# EAGLE design wagband_schematic_post_route (EAGLE 7.5.0)
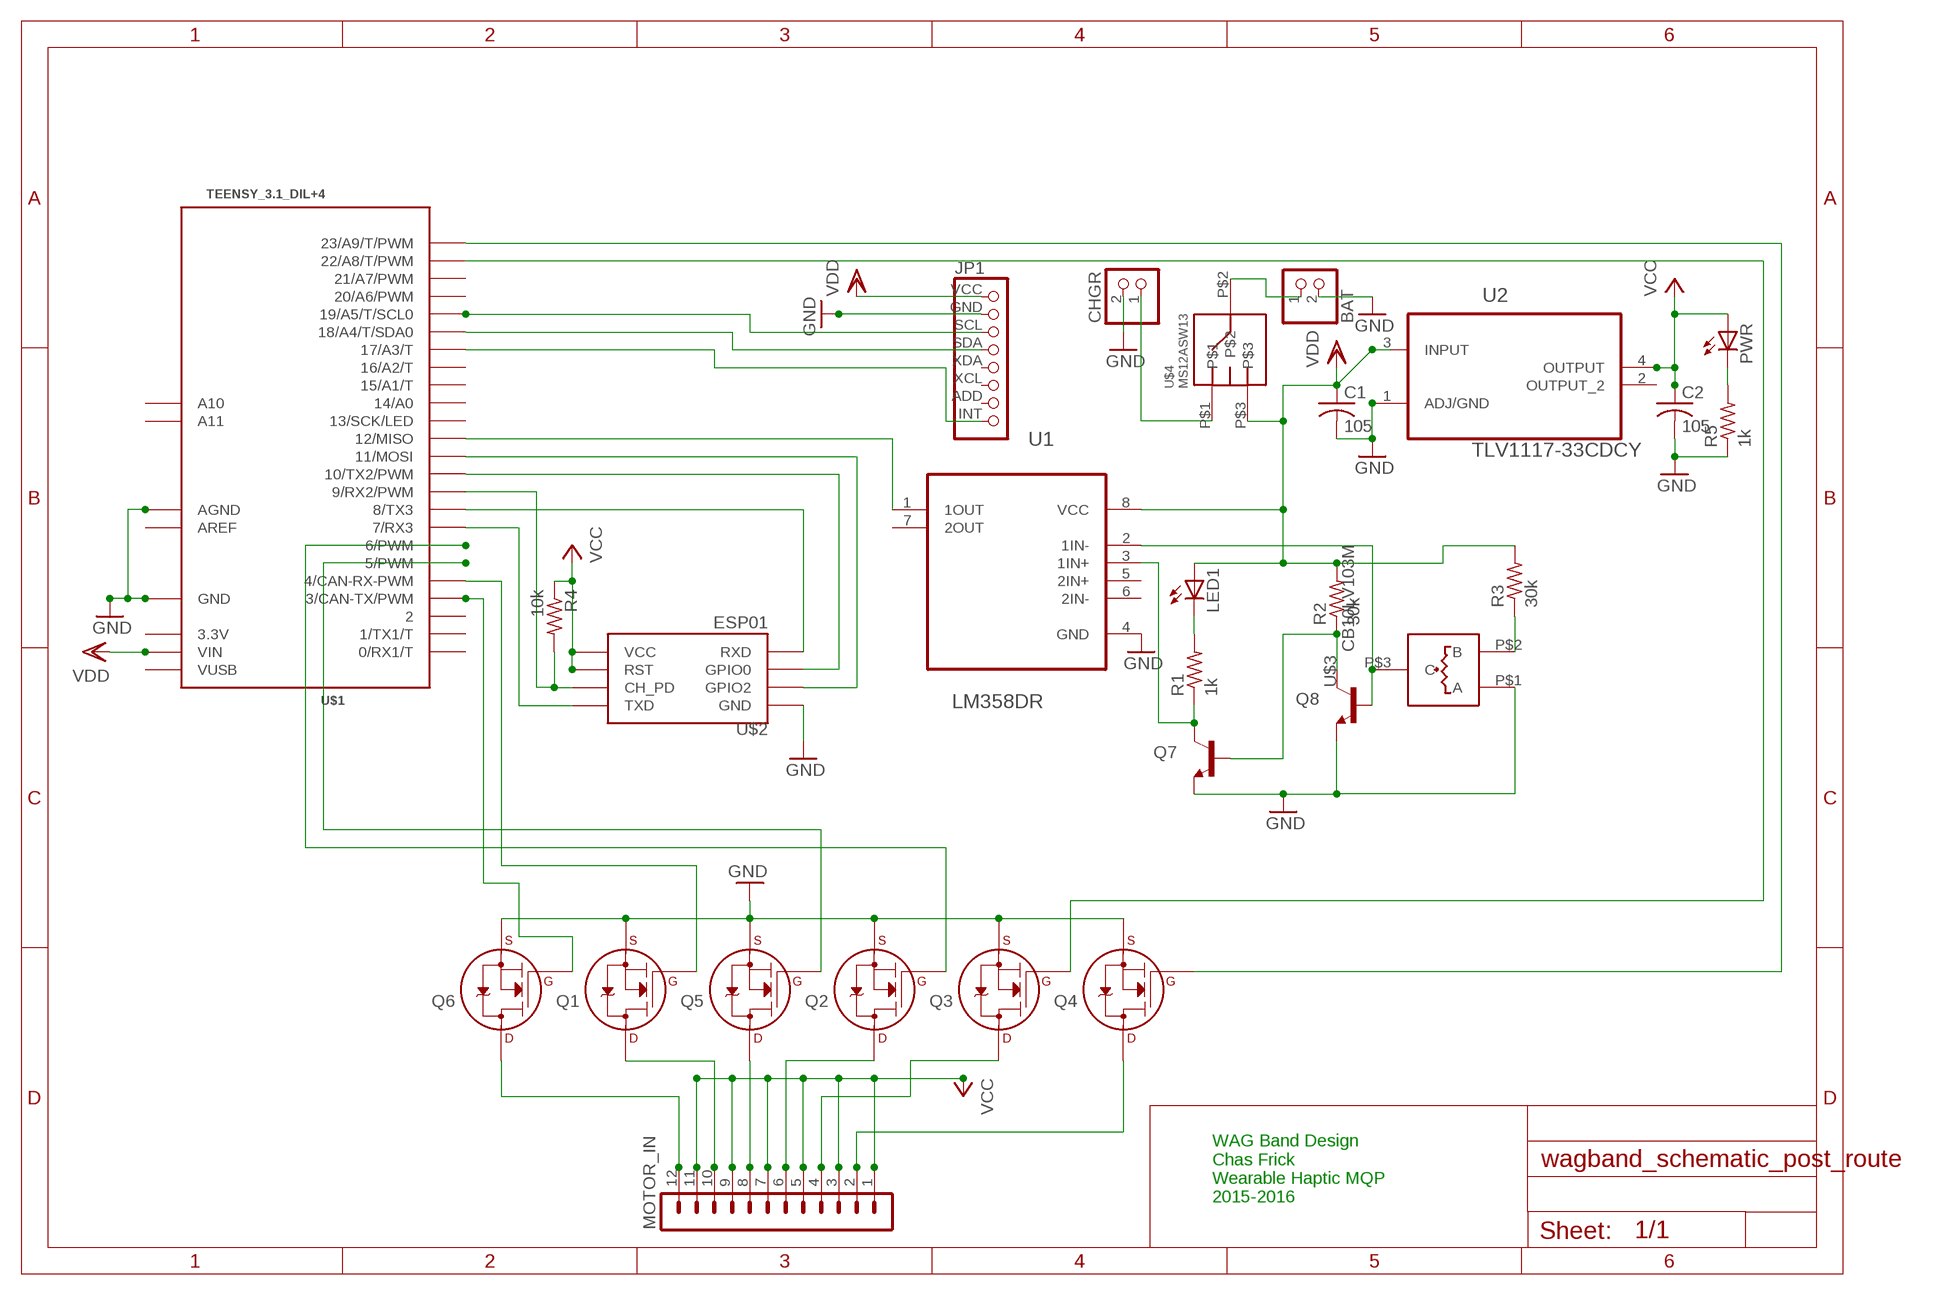
[diagram p0: schematic, sheet 1]

## Parts
BAT  JST_2PIN-THM-RA  [JST-PH-2-THM-RA]
C1  105  C-USC0805K  [C0805K]
C2  105  C-USC0805K  [C0805K]
CHGR  JST_2PIN-THM-RA  [JST-PH-2-THM-RA]
JP1  MPU6050_BREAKOUT  [MPU6050]
LED1  LED5MM  [LED5MM]
MOTOR_IN  MA12-1W  [MA12-1W]
PWR  LED5MM  [LED5MM]
Q1  2N7000_SOT23  [SOT-23]
Q2  2N7000_SOT23  [SOT-23]
Q3  2N7000_SOT23  [SOT-23]
Q4  2N7000_SOT23  [SOT-23]
Q5  2N7000_SOT23  [SOT-23]
Q6  2N7000_SOT23  [SOT-23]
Q7  TRANSISTOR_NPNMMBT3904  [SOT-23]
Q8  TRANSISTOR_NPNMMBT3904  [SOT-23]
R1  1k  R-US_R1206  [R1206]
R2  30k  R-US_R1206  [R1206]
R3  30k  R-US_R1206  [R1206]
R4  10k  R-US_R1206  [R1206]
R5  1k  R-US_R1206  [R1206]
U1  LM358DR  [SOIC127P600X175-8N]
U2  TLV1117-33CDCY  [SOT230P700X180-4N]
U$1  TEENSY_3.1_DIL+4  [TEENSY3-DIL+4]
U$2  ESP01  [ESP01]
U$3  CB10LV103M  [CB10]
U$4  MS12ASW13  [SPDT]

## Nets
GND [GND]: BAT.2 C1.2 C2.2 CHGR.2 JP1.GND Q1.2(S) Q2.2(S) Q3.2(S) Q4.2(S) Q5.2(S) Q6.2(S) Q7.2(E) Q8.2(E) R5.1 U1.4(GND) U2.1(ADJ/GND) U$1.AGND U$1.GND U$2.GND U$3.P$1(A)
N$1: Q4.1(G) U$1.23/A9(23/A9/T/PWM)
N$2: Q2.1(G) U$1.6(6/PWM)
N$3: Q3.1(G) U$1.22/A8(22/A8/T/PWM)
N$4: JP1.SDA U$1.18/A4(18/A4/T/SDA0)
N$5: Q6.1(G) U$1.3(3/CAN-TX/PWM)
N$6: Q1.1(G) U$1.4(4/CAN-RX-PWM)
N$7: U$1.7(7/RX3) U$2.TX(TXD)
N$8: JP1.INT U$1.17/A3(17/A3/T)
N$9: MOTOR_IN.12 Q6.3(D)
N$10: MOTOR_IN.10 Q1.3(D)
N$11: MOTOR_IN.8 Q5.3(D)
N$12: U$1.8(8/TX3) U$2.RX(RXD)
N$13: MOTOR_IN.6 Q2.3(D)
N$14: MOTOR_IN.2 Q4.3(D)
N$15: MOTOR_IN.4 Q3.3(D)
N$16: Q5.1(G) U$1.5(5/PWM)
N$17: JP1.SCL U$1.19/A5(19/A5/T/SCL0)
N$18: U$1.11(11/MOSI) U$2.GPIO2
N$19: U$1.10(10/TX2/PWM) U$2.GPIO0
N$20: Q7.3(C) R1.1 U1.3(1IN+)
N$21: PWR.K(C) R5.2
N$22: LED1.K(C) R1.2
N$23: Q7.1(B) Q8.3(C) R2.1
N$24: R4.2 U$1.9(9/RX2/PWM) U$2.CH_PD
N$25: Q8.1(B) U1.2(1IN-) U$3.P$3(C)
N$26: U1.1(1OUT) U$1.12(12/MISO)
N$27: R3.1 U$3.P$2(B)
N$28: BAT.1 U$4.P$2
N$29 [VCC]: CHGR.1 U$4.P$1
VCC [VCC]: C2.1 MOTOR_IN.1 MOTOR_IN.3 MOTOR_IN.5 MOTOR_IN.7 MOTOR_IN.9 MOTOR_IN.11 PWR.A R4.1 U2.4(OUTPUT) U$2.RST U$2.VCC
VDD [VCC]: C1.1 JP1.VCC LED1.A R2.2 R3.2 U1.8(VCC) U2.3(INPUT) U$1.VIN U$4.P$3
Unconnected: JP1.ADD JP1.XCL JP1.XDA U1.5(2IN+) U1.6(2IN-) U1.7(2OUT) U2.2(OUTPUT_2) U$1.0(0/RX1/T) U$1.1(1/TX1/T) U$1.2 U$1.13(13/SCK/LED) U$1.14/A0 U$1.15/A1(15/A1/T) U$1.16/A2(16/A2/T) U$1.20/A6(20/A6/PWM) U$1.21/A7(21/A7/PWM) U$1.A10 U$1.A11

## Notes on the sheet
- WAG Band Design
  Chas Frick
  Wearable Haptic MQP
  2015-2016

## Power pins joined to a net without a drawn wire
3.3V: U$1.3.3V
AREF: U$1.AREF
VUSB: U$1.VUSB

## Library data of the parts
BAT CHGR = adafruit:JST_2PIN: JST 2-Pin Connectors of various flavors SMT-RA (S2B-PH-SM4) 4UConnector #17311 SMT (B2B-PH-SM4) THM-RA (S2B-PH) THM (B2B-PH)
C1 C2 = resistor:C-US: CAPACITOR, American symbol
JP1 = mqp_custom_parts:MPU6050_BREAKOUT: PIN HEADER
LED1 PWR = led:LED: LED OSRAM: - CHIPLED LG R971, LG N971, LY N971, LG Q971, LY Q971, LO R971, LY R971 LH N974, LH R974 LS Q976, LO Q976, LY Q976 LO Q996 - Hyper CHIPLED LW Q18S LB Q993, LB Q99A, LB R99A - SideLED LS A670, LO A670, LY A670, LG A670, LP A670 LB A673, LV A673, LT A673, LW A673 LH A674 LY A675 LS A676, LA A676, LO A676, LY A676, LW A676 LS A679, LY A679, LG A679 - Hyper Micro SIDELED® LS Y876, LA Y876, LO Y876, LY Y876 LT Y87S - SmartLED LW L88C, LW L88S LB L89C, LB L89S, LG L890 LS L89K, LO L89K, LY L89K LS L896, LA L896, LO L896, LY L896 - TOPLED LS T670, LO T670, LY T670, LG T670, LP T670 LSG T670, LSP T670, LSY T670, LOP T670, LYG T670 LG T671, LOG T671, LSG T671 LB T673, LV T673, LT T673, LW T673 LH T674 LS T676, LA T676, LO T676, LY T676, LB T676, LH T676, LSB T676, LW T676 LB T67C, LV T67C, LT T67C, LS T67K, LO T67K, LY T67K, LW E67C LS E67B, LA E67B, LO E67B, LY E67B, LB E67C, LV E67C, LT E67C LW T67C LS T679, LY T679, LG T679 LS T770, LO T770, LY T770, LG T770, LP T770 LB T773, LV T773, LT T773, LW T773 LH T774 LS E675, LA E675, LY E675, LS T675 LS T776, LA T776, LO T776, LY T776, LB T776 LHGB T686 LT T68C, LB T68C - Hyper Mini TOPLED® LB M676 - Mini TOPLED Santana® LG M470 LS M47K, LO M47K, LY M47K Source: http://www.osram.convergy.de LUXEON: - LUMILED® LXK2-PW12-R00, LXK2-PW12-S00, LXK2-PW14-U00, LXK2-PW14-V00 LXK2-PM12-R00, LXK2-PM12-S00, LXK2-PM14-U00 LXK2-PE12-Q00, LXK2-PE12-R00, LXK2-PE12-S00, LXK2-PE14-T00, LXK2-PE14-U00 LXK2-PB12-K00, LXK2-PB12-L00, LXK2-PB12-M00, LXK2-PB14-N00, LXK2-PB14-P00, LXK2-PB14-Q00 LXK2-PR12-L00, LXK2-PR12-M00, LXK2-PR14-Q00, LXK2-PR14-R00 LXK2-PD12-Q00, LXK2-PD12-R00, LXK2-PD12-S00 LXK2-PH12-R00, LXK2-PH12-S00 LXK2-PL12-P00, LXK2-PL12-Q00, LXK2-PL12-R00 Source: www.luxeon.com KINGBRIGHT: KA-3528ASYC Source: www.kingbright.com
MOTOR_IN = con-lstb:MA12-1W: PIN HEADER; OC_FARNELL: unknown; OC_NEWARK: unknown
Q1-Q6 = mqp_custom_parts:2N700*: 2N7000, 2N7002, NDS7002A N-channel enhancement mode MOSFET
Q7 Q8 = mqp_custom_parts:TRANSISTOR_NPN: MMBT3904LT1G Made for the MMBT3904LT1G from ON Semiconductor See here: http://www.newark.com/on-semiconductor/mmbt3904lt1g/bipolar-transistor-npn-40v-sot/dp/83H7337 NPN BJT with 200mA capacity and 40V Vce breakdown
R1-R5 = resistor:R-US_: RESISTOR, American symbol
U1 = Texas Instruments_By_element14_Batch_1:LM358DR: OPERATIONAL AMPLIFIERS; MPN: LM358DR; OC_FARNELL: 1831865; OC_NEWARK: 34K7599; PACKAGE: SOIC-8; SUPPLIER: Texas Instruments
U2 = Texas Instruments_By_element14_Batch_1:TLV1117-33CDCY: V REG, LDO, 3.3V, 0.8A; MPN: TLV1117-33CDCY; OC_FARNELL: 1494942; OC_NEWARK: 67K8520; PACKAGE: SOT-223-3; SUPPLIER: TEXAS INSTRUMENTS
U$1 = Teensy_3_and_LC_Series_Boards_v1.1:TEENSY_3.1_DIL+4: Teensy 3.1 and 3.2 in a DIL package with the inner 4 pins
U$2 = esp8266modules:ESP01: ESP8266 Wifi module 01
U$3 = mqp_custom_parts:CB10LV103M
U$4 = mqp_custom_parts:MS12ASW13

## Net classes
0 default: width 0.305 mm
1 GND: width 0.406 mm
2 VCC: width 0.406 mm

## Board
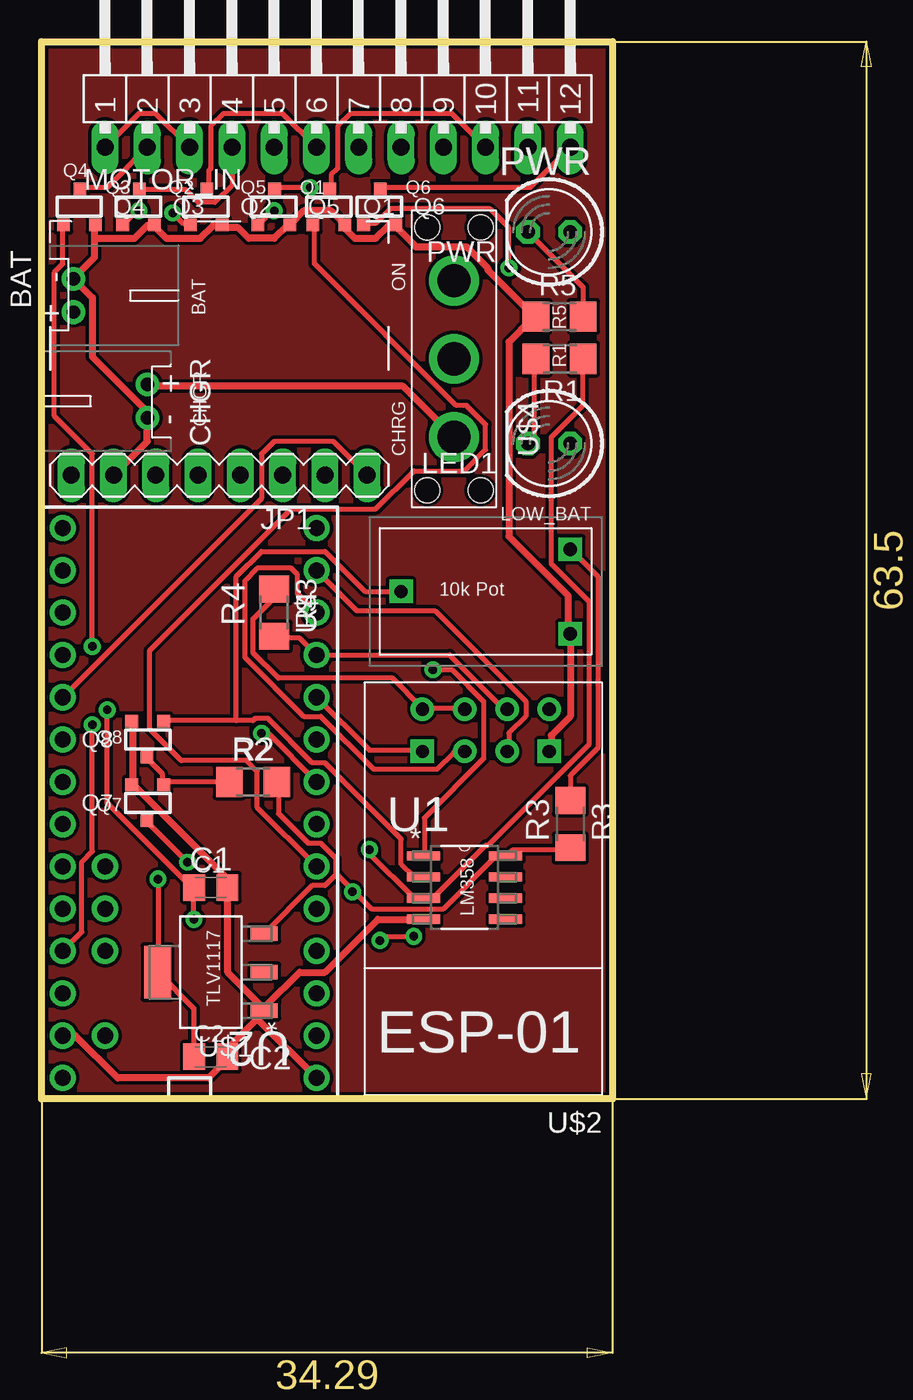
[diagram p1: board, top side]
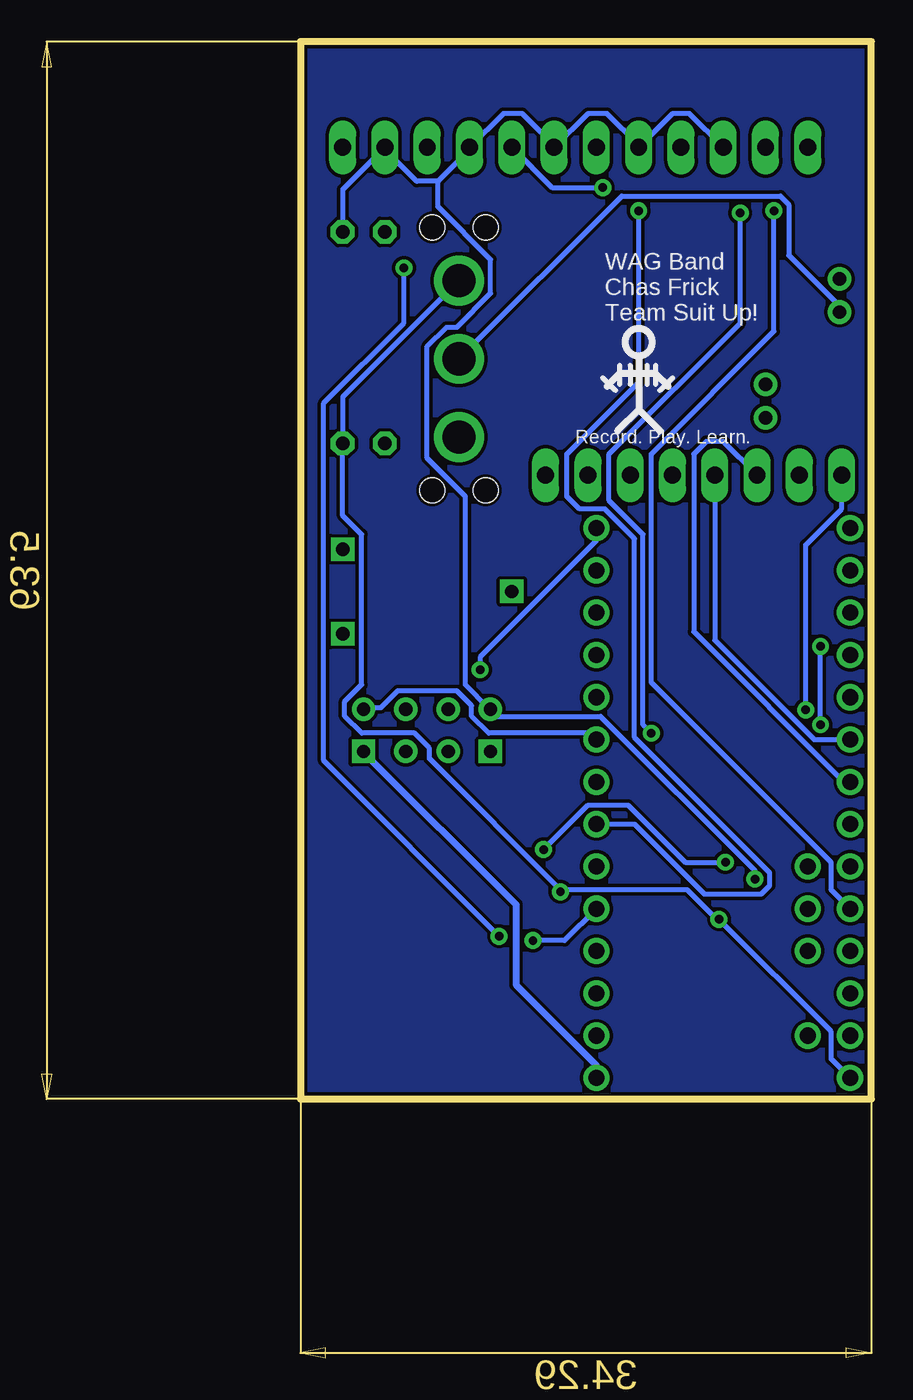
[diagram p2: board, bottom side, seen from below]

Size 34.29 x 63.5 mm. Coordinates in mm from the lower left corner, seen from the top.
Outline: 0,0 0,63.5 34.29,63.5 34.29,0 0,0
Copper layers (1*16): Top 0.035mm / dielectric 1.5mm / Bottom 0.035mm
Design rules "SparkFun": minimum track width 8mil, minimum drill 20mil, track to track 8mil, track to pad 8mil, pad to pad 8mil, via to via 8mil, smd to smd 8mil, copper to edge 8mil, drill to drill 8mil, minimum pad ring 12mil, minimum via ring 10mil, stop-mask expansion 4mil, vias tented up to drill 20mil, thermal gap 10mil

### Footprints (pad centres in the part's own frame; a part is rotated, then mirrored left to right if it is on the bottom)
JST-PH-2-THM-RA = drill 0.8 pad 1.422: 1 1,0; 2 -1,0
C0805K = smd 1.3 x 1.6: 1 -1,0; 2 1,0
MPU6050 = drill 1.016 long: ADD 6.35,0; GND -6.35,0; INT 8.89,0; SCL -3.81,0; SDA -1.27,0; VCC -8.89,0; XCL 3.81,0; XDA 1.27,0
LED5MM = drill 0.813 octagon: A -1.27,0; K 1.27,0
MA12-1W = drill 1.016 long: 1 -13.97,0; 2 -11.43,0; 3 -8.89,0; 4 -6.35,0; 5 -3.81,0; 6 -1.27,0; 7 1.27,0; 8 3.81,0; 9 6.35,0; 10 8.89,0; 11 11.43,0; 12 13.97,0
SOT-23 = smd 0.762 x 0.762: 1 -0.979,-1.101; 2 0.94,-1.101; 3 0.025,1.067
R1206 = smd 1.6 x 1.803: 1 -1.422,0; 2 1.422,0
SOIC127P600X175-8N = smd 1.981 x 0.559: 1 -2.464,1.905; 2 -2.464,0.635; 3 -2.464,-0.635; 4 -2.464,-1.905; 5 2.464,-1.905; 6 2.464,-0.635; 7 2.464,0.635; 8 2.464,1.905
SOT230P700X180-4N = smd 1.626 x 0.889: 1 -3.2,2.311; 2 -3.2,0; 3 -3.2,-2.311 | smd 1.626 x 3.175: 4 3.2,0
TEENSY3-DIL+4 = drill 0.965: 0 -7.62,13.97; 1 -7.62,11.43; 2 -7.62,8.89; 3 -7.62,6.35; 3.3V 7.62,11.43; 4 -7.62,3.81; 5 -7.62,1.27; 6 -7.62,-1.27; 7 -7.62,-3.81; 8 -7.62,-6.35; 9 -7.62,-8.89; 10 -7.62,-11.43; 11 -7.62,-13.97; 12 -7.62,-16.51; 13 7.62,-16.51; 14/A0 7.62,-13.97; 15/A1 7.62,-11.43; 16/A2 7.62,-8.89; 17/A3 7.62,-6.35; 18/A4 7.62,-3.81; 19/A5 7.62,-1.27; 20/A6 7.62,1.27; 21/A7 7.62,3.81; 22/A8 7.62,6.35; 23/A9 7.62,8.89; A10 5.08,6.35; A11 5.08,3.81; AGND 7.62,13.97; AREF 5.08,8.89; GND -7.62,16.51; VIN 7.62,16.51; VUSB 5.08,13.97
ESP01 = drill 0.8: CH_PD -1.285,-8.178; GPIO0 1.255,-5.638; GPIO2 -1.285,-5.638; RST 1.255,-8.178; TX -3.825,-8.178; VCC 3.795,-8.178 | drill 0.8 square: GND -3.825,-5.638; RX 3.795,-5.638
CB10 = drill 0.8 square: P$1 -2.54,-5.08; P$2 2.54,-5.08; P$3 0,5.08
SPDT = drill 2: P$1 0,-4.699; P$2 0,0; P$3 0,4.699 | hole 1.5: 1.6,7.899; -1.6,-7.899; 1.6,-7.899; -1.6,7.899

### Placement (x,y rotation side)
BAT  1.91,48.26 270 top
C1  10.16,12.7 0 top
C2  10.16,2.54 0 top
CHGR  6.35,41.91 90 top
JP1  10.67,37.47 0 top
LED1  30.48,39.37 180 top
MOTOR_IN  17.78,57.15 0 top
PWR  30.48,52.07 180 top
Q1  17.27,53.59 0 top
Q2  9.91,53.59 0 top
Q3  5.84,53.59 0 top
Q4  2.29,53.59 0 top
Q5  13.97,53.59 0 top
Q6  20.32,53.59 0 top
Q7  6.35,17.78 180 top
Q8  6.35,21.59 180 top
R1  31.11,44.45 180 top
R2  12.7,19.05 0 top
R3  31.75,16.51 270 top
R4  13.97,29.21 270 top
R5  31.11,46.99 0 top
U1  25.4,12.7 0 top
U2  10.16,7.62 180 top
U$1  8.89,17.78 180 top
U$2  26.67,15.24 180 top
U$3  26.67,30.48 90 top
U$4  24.77,44.45 0 top

### Tracks (layer width: path | path; a pad name or v marks a point on that pad's centre or on a via)
GND
  Top 0.406: Q8.2 5.46,22.61 5.46,18.92 Q7.2 5.59,18.8 11.05,13.34 11.05,12.83 C1.2 11.18,12.7 11.18,7.62 13.34,5.46 U2.1 | 12.95,4.83 13.34,5.21 U2.1 | 12.95,4.83 11.18,3.05 11.18,2.54 C2.2 11.18,2.41 10.03,1.27 4.57,1.27 2.03,3.81 U$1.AGND | U1.4 20.19,10.79 17.02,7.62 15.49,7.62 13.46,5.59 U2.1 | 12.95,4.83 U$1.GND | JP1.GND 6.35,39.5 CHGR.2 6.22,41.02 6.22,41.4 3.05,44.58 3.05,48.13 2.03,49.15 BAT.2 1.91,49.28 3.17,50.55 3.17,51.69 | 3.17,51.69 3.17,52.45 Q4.2 | 3.17,51.69 5.59,51.69 6.35,52.45 6.73,52.45 Q3.2 6.86,52.32 7.49,51.69 9.53,51.69 10.29,52.45 10.79,52.45 Q2.2 10.92,52.32 11.81,52.32 12.45,51.69 13.97,51.69 14.73,52.45 Q5.2 14.99,52.58 15.75,53.34 17.4,53.34 18.16,52.58 Q1.2 18.16,52.32 18.8,51.69 20.07,51.69 20.83,52.45 21.21,52.45 Q6.2 21.34,52.32 22.48,51.18 25.53,51.18 26.8,49.91 26.8,49.78 29.59,46.99 R5.1 29.46,46.86 28.07,45.47 28.07,33.78 31.62,30.23 31.62,28.07 U$3.P$1 31.75,22.99 30.61,21.84 30.61,20.95 U$2.GND
  Bottom 0.406: U$1.GND 16.51,2.03 21.34,6.86 21.34,11.68 30.48,20.83 U$2.GND
N$1  (via drill 0.51)
  Top 0.305: v3.05,27.18 3.05,38.73 0.76,41.02 0.76,49.66 1.27,50.16 1.27,52.45 Q4.1 | v3.05,22.48 3.05,14.86 2.41,14.22 2.41,10.03 U$1.23/A9
  Bottom 0.305: v3.05,22.48 v3.05,27.18
N$2  (via drill 0.51)
  Top 0.305: v7.87,53.21 8.51,52.58 8.89,52.58 Q2.1 | v13.21,21.97 13.59,21.97 U$1.6
  Bottom 0.305: v7.87,53.21 7.87,46.61 15.75,38.73 15.75,35.94 13.72,33.91 13.72,22.48 v13.21,21.97
N$3  (via drill 0.51)
  Top 0.305: v5.84,53.34 5.71,53.34 4.95,52.58 Q3.1
  Bottom 0.305: v5.84,53.34 5.84,46.1 13.21,38.73 13.21,25.02 2.41,14.22 2.41,12.57 U$1.22/A8
N$4
  Bottom 0.305: U$1.18/A4 3.43,21.59 9.4,27.56 JP1.SDA
N$5  (via drill 0.51)
  Top 0.305: v28.07,49.91 28.07,52.32 26.92,53.47 20.95,53.47 20.07,52.58 19.43,52.58 Q6.1 | v22.35,9.78 20.57,9.78 v20.32,9.53
  Bottom 0.305: v28.07,49.91 28.07,46.61 32.89,41.78 32.89,20.32 v22.35,9.78 | v20.32,9.53 18.41,9.53 U$1.3
N$6
  Top 0.305: U$1.4 12.95,17.53 12.95,19.68 12.32,20.32 8.38,20.32 6.48,22.23 6.48,26.92 14.99,35.43 20.07,35.43 22.35,37.72 25.4,37.72 26.67,38.99 26.67,40.51 25.53,41.66 24.89,41.66 16.38,50.16 16.38,52.45 Q1.1
N$7
  Bottom 0.305: U$1.7 16.89,21.97 22.99,21.97 24,22.99 24,23.62 24.89,24.51 28.45,24.51 29.46,23.5 30.48,23.5 U$2.TX
N$8
  Top 0.305: U$1.17/A3 13.21,36.07 13.21,38.73 13.97,39.5 17.53,39.5 JP1.INT
N$9
  Top 0.305: MOTOR_IN.12 29.34,54.74 20.45,54.74 Q6.3
N$10
  Top 0.305: MOTOR_IN.10 24.64,59.18 18.54,59.18 17.78,58.42 17.78,55.88 17.4,55.5 17.4,54.74 Q1.3
N$11  (via drill 0.51)
  Top 0.305: v16.13,54.74 14.1,54.74 Q5.3
  Bottom 0.305: v16.13,54.74 19.18,54.74 MOTOR_IN.8
N$12
  Top 0.305: U$1.8 19.68,20.95 22.86,20.95 U$2.RX
N$13
  Top 0.305: MOTOR_IN.6 14.48,59.18 10.92,59.18 10.16,58.42 10.16,55.88 10.03,55.75 10.03,54.74 Q2.3
N$14
  Top 0.305: MOTOR_IN.2 3.94,54.74 2.41,54.74 Q4.3
N$15
  Top 0.305: MOTOR_IN.4 11.43,54.86 10.41,53.85 9.4,53.85 8.64,54.61 5.97,54.61 Q3.3
N$16  (via drill 0.51)
  Top 0.305: v13.97,53.34 13.84,53.34 13.08,52.58 Q5.1
  Bottom 0.305: v13.97,53.34 13.97,43.05 18.29,38.73 18.29,36.2 17.53,35.43 16,35.43 14.22,33.66 14.22,21.72 6.1,13.59 6.1,12.83 6.6,12.32 10.03,12.32 14.22,16.51 U$1.5
N$17
  Bottom 0.305: U$1.19/A5 1.65,19.05 10.67,28.07 10.67,38.73 9.91,39.5 8.89,39.5 JP1.SCL
N$18
  Top 0.305: U$1.11 18.92,29.34 23.62,29.34 29.08,23.88 29.08,22.99 28.07,21.97 28.07,20.95 U$2.GPIO2
N$19
  Top 0.305: U$1.10 15.37,30.35 15.37,31.5 14.99,31.88 12.95,31.88 12.19,31.11 12.19,26.54 15.75,22.99 16.76,22.99 19.94,19.81 23.75,19.81 24.77,20.83 25.4,20.83 U$2.GPIO0
N$20  (via drill 0.51)
  Top 0.305: v8.76,14.22 6.35,16.64 Q7.3 | v19.68,14.99 19.68,14.73 22.35,12.06 U1.3 22.99,12.19 23.62,12.19 26.67,15.24 26.8,15.24 32.89,21.34 32.89,29.84 30.61,32.13 30.61,39.75 32.51,41.66 32.51,44.45 R1.1
  Bottom 0.305: v8.76,14.22 11.18,14.22 14.61,17.65 17.02,17.65 v19.68,14.99
N$21
  Top 0.305: PWR.K 32.51,48.77 32.51,46.99 R5.2
N$22
  Top 0.305: LED1.K 29.59,39.75 29.59,44.45 R1.2
N$23
  Top 0.305: Q8.3 6.35,20.45 7.24,19.56 7.24,18.92 Q7.1 7.37,19.05 R2.1
N$24
  Top 0.305: R4.2 13.97,27.69 15.49,27.69 U$1.9 24.51,26.67 27.69,23.5 27.94,23.5 U$2.CH_PD
N$25
  Top 0.305: 11.68,22.73 12.7,22.73 12.83,22.86 13.59,22.86 16.26,20.19 17.02,20.19 21.59,15.62 21.59,14.1 22.35,13.34 U1.2 | 11.68,22.73 7.37,22.73 Q8.1 | U$3.P$3 19.43,30.48 17.02,32.89 13.21,32.89 11.68,31.37 11.68,22.73
N$26  (via drill 0.51)
  Top 0.305: v23.5,25.78 24.64,25.78 26.54,23.88 26.54,20.45 22.99,16.89 22.99,14.61 U1.1
  Bottom 0.305: v23.5,25.78 23.5,26.54 16.51,33.53 U$1.12
N$27
  Top 0.305: R3.1 31.75,19.43 33.4,21.08 33.4,31.37 U$3.P$2
N$28
  Bottom 0.305: BAT.1 1.91,47.62 4.95,50.67 4.95,53.72 5.46,54.23 14.99,54.23 U$4.P$2
N$29
  Top 0.406: U$4.P$1 21.72,42.8 6.35,42.8 CHGR.1
N$30
  pour Bottom: 0,63.5 0,0 34.29,0 34.29,63.5
N$31
  pour Top: 0,63.5 0,0 34.29,0 34.29,63.5
VCC  (via drill 0.51)
  Top 0.305: MOTOR_IN.1 5.84,59.18 6.86,59.18 MOTOR_IN.3 | C2.1 9.14,2.54 9.14,5.46 6.99,7.62 U2.4 6.99,7.75 v6.99,13.21 | R4.1 13.97,30.1 12.7,28.83 12.7,26.8 14.22,25.27 21.08,25.27 22.86,23.5 U$2.VCC 22.99,23.5 25.4,23.5 U$2.RST
  Bottom 0.305: PWR.A 31.75,54.61 MOTOR_IN.11 29.21,57.02 27.3,55.12 26.04,55.12 | MOTOR_IN.3 10.92,59.18 11.94,59.18 MOTOR_IN.5 13.97,57.28 15.88,59.18 17.02,59.18 MOTOR_IN.7 19.05,57.28 20.95,59.18 22.1,59.18 MOTOR_IN.9 24.13,57.02 26.04,55.12 | v6.99,13.21 6.99,13.72 16.26,22.99 22.48,22.99 22.86,23.37 U$2.VCC 22.99,23.5 24.38,24.89 24.38,36.2 26.67,38.48 26.67,45.21 25.53,46.35 24.89,46.35 22.86,48.39 22.86,50.42 26.04,53.59 26.04,55.12
VDD  (via drill 0.51)
  Top 0.305: R3.2 31.75,14.99 28.32,14.99 27.94,14.61 U1.8 27.81,14.48 27.18,14.48 24.13,11.43 19.81,11.43 18.73,12.51 | U2.3 16.26,12.83 17.02,12.83 17.65,13.46 | 17.65,13.46 17.65,14.48 16.76,15.37 16,15.37 14.22,17.14 14.22,19.05 R2.2 | 18.73,12.51 17.78,13.46 17.65,13.46 | v9.14,10.79 9.14,12.7 C1.1 9.02,12.7 3.94,17.78 v3.94,23.37 | v18.67,12.45 18.73,12.51
  Bottom 0.305: U$4.P$3 31.75,42.16 LED1.A 31.75,35.05 30.61,33.91 30.61,24.89 31.62,23.88 31.62,22.99 30.61,21.97 27.43,21.97 26.54,21.08 26.54,20.45 18.67,12.57 | U$1.VIN 2.41,2.41 2.41,4.06 v9.14,10.79 9.27,10.79 11.05,12.57 18.67,12.57 | JP1.VCC 1.78,35.43 3.94,33.27 v3.94,23.37 | v18.67,12.45 18.67,12.57

### Text on the board
tPlace: PWR | Q4 | Q3 | Q2 | Q5 | Q1 | Q6 | BAT | ON | R5 | R1 | CHGR | CHRG | LOW_BAT | 10k Pot | R4 | Q8 | R2 | Q7 | R3 | C1 | LM358 | TLV1117 | C2
bPlace: WAG Band / Chas Frick / Team Suit Up! | Record. Play. Learn.